# Altium project automatic bell.PrjPcb
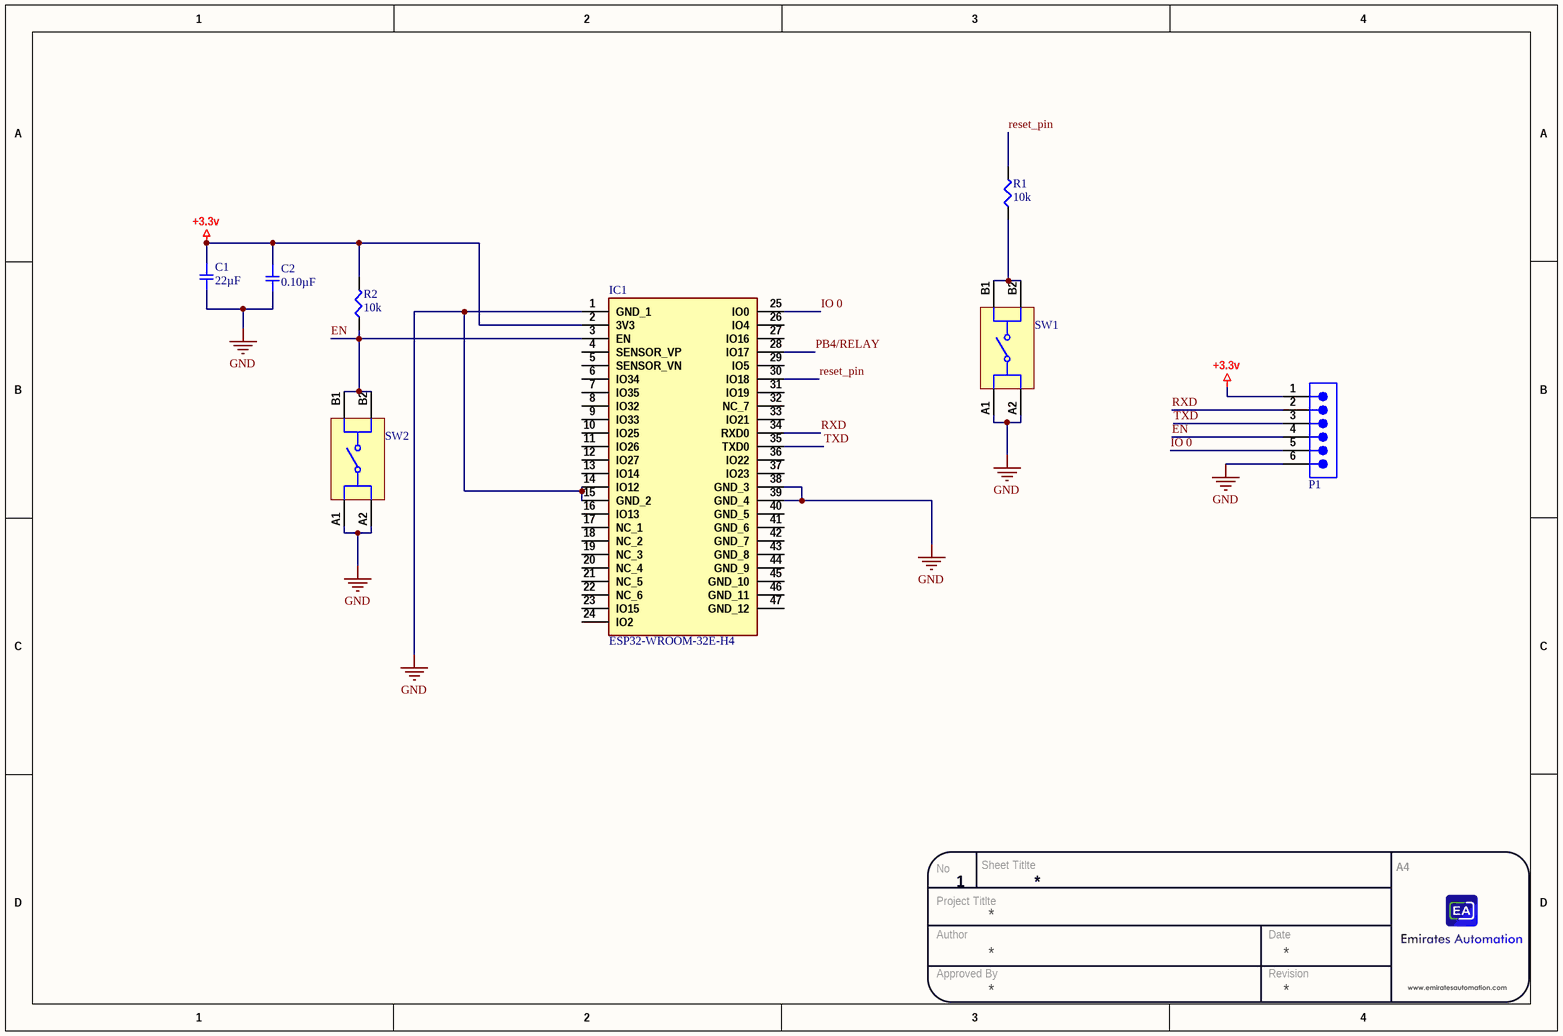
[diagram p0: main.SchDoc]
3 sheets, 36 parts. Net scope: global (net labels, ports and power ports of the same name join across sheets).
Board file: PCB.PcbDoc
Sheets:
  main.SchDoc
  relay and rtc.SchDoc
  power supply.SchDoc

## Sheet main.SchDoc
size A4; Organization: ORGANIZATION; Address1: ADDRESS 1; Address2: ADDRESS 2; Address3: ADDRESS 3; Address4: ADDRESS 4; Revision: -; SheetNumber: 1; SheetTotal: 3

### Parts
C1  22µF  [SMD-0603C]
C2  0.10µF  [SMD-0603C]
IC1  ESP32-WROOM-32E-H4  [ESP32WROOM32UEM113EH2800UH3Q0]
P1  61300611121  [61300611121]  (value not drawn)
R1  10k  [SMD-0603-RES]
R2  10k  [SMD-0603-RES]
SW1  430476085716  [430476085716]  (value not drawn)
SW2  430476085716  [430476085716]  (value not drawn)

### Nets
+3.3v: C1.1 C2.1 IC1.2(3V3) P1.1 R2.2
GND: C1.2 C2.2 IC1.1(GND_1) IC1.14(IO12) IC1.15(GND_2) IC1.38(GND_3) IC1.39(GND_4) P1.6 SW1.A1 SW1.A2 SW2.A1 SW2.A2
EN: IC1.3(EN) P1.4 R2.1 SW2.B1 SW2.B2
IO 0: IC1.25(IO0) P1.5
PB4/RELAY: IC1.28(IO17)
reset_pin: IC1.30(IO18) R1.2
RXD: IC1.34(RXD0) P1.2
TXD: IC1.35(TXD0) P1.3
NetR1_1: R1.1 SW1.B1 SW1.B2

Not connected (* = marked no-connect by the designer): IC1 4(SENSOR_VP) 5(SENSOR_VN) 6(IO34) 7(IO35) 8(IO32) 9(IO33) 10(IO25) 11(IO26) 12(IO27) 13(IO14) 16(IO13) 17(NC_1) 18(NC_2) 19(NC_3) 20(NC_4) 21(NC_5) 22(NC_6) 23(IO15) 24(IO2) 26(IO4) 27(IO16) 29(IO5) 31(IO19) 32(NC_7) 33(IO21) 36(IO22) 37(IO23) 40(GND_5) 41(GND_6) 42(GND_7) 43(GND_8) 44(GND_9) 45(GND_10) 46(GND_11) 47(GND_12)

### Notes on the sheet
- No
- Project Titlte
- Sheet Titlte
- A4
- Author
- Approved By
- Date
- Revision

### Library data of the parts
C1 = GRM188R61A226ME15D: CAP CER 22UF 10V X5R 0603; Manufacturer: Murata Electronics North America; Factory Stock: 0; Unit Price (USD): 0.24; Minimum Quantity: 1; Tolerance: ±20%; Datasheets: http://www.murata.com/~/media/webrenewal/support/library/catalog/products/capacitor/mlcc/c02e.pdf; Image: //media.digikey.com/Renders/Murata%20Renders/ZRB-SERIES-0402.jpg; Digi-Key Part Number: 490-10476-1-ND; Part Number: GRM188R61A226ME15D; Quantity Available: 179406; @ qty: 0; Packaging: Cut Tape (CT); Series: GRM; Part Status: Active; Value: 22µF; Voltage: 10V; Temperature Coefficient: X5R; Operating Temperature: -55°C ~ 85°C; Features: Derating Recommended; Ratings: -; Applications: General Purpose; Mounting Type: Surface Mount, MLCC; Package / Case: 0603 (1608 Metric); Size / Dimension: 0.063" L x 0.031" W (1.60mm x 0.80mm); Height - Seated (Max): -; Thickness (Max): 0.039" (1.00mm); Lead Spacing: -; Lead Style: -
C2 = GCJ188R71C104KA01D: CAP CER 0.1UF 16V X7R 0603; Manufacturer: Murata Electronics North America; Factory Stock: 0; Unit Price (USD): 0.21; Minimum Quantity: 1; Tolerance: ±10%; Datasheets: http://www.murata.com/~/media/webrenewal/support/library/catalog/products/capacitor/mlcc/c03e.ashx; Image: //media.digikey.com/Renders/Murata%20Renders/0603%28LQG18%29.jpg; Digi-Key Part Number: 490-5796-1-ND; Part Number: GCJ188R71C104KA01D; Quantity Available: 22473; @ qty: 0; Packaging: Cut Tape (CT); Series: GCJ; Part Status: Active; Value: 0.10µF; Voltage: 16V; Temperature Coefficient: X7R; Operating Temperature: -55°C ~ 125°C; Features: Soft Termination; Ratings: AEC-Q200; Applications: Automotive, Boardflex Sensitive; Mounting Type: Surface Mount, MLCC; Package / Case: 0603 (1608 Metric); Size / Dimension: 0.063" L x 0.031" W (1.60mm x 0.80mm); Height - Seated (Max): -; Thickness (Max): 0.035" (0.90mm); Lead Spacing: -; Lead Style: -
IC1 = ESP32-WROOM-32E-H4: Integrated Circuit; Manufacturer_Name: Espressif Systems; Datasheet Link: https://www.espressif.com/sites/default/files/documentation/esp32-wroom-32e_esp32-wroom-32ue_datasheet_en.pdf; Height: 3.25mm; Manufacturer_Part_Number: ESP32-WROOM-32E-H4; Mouser Part Number: 356-ESP32WRM320EH3PS; Mouser Price/Stock: https://www.mouser.co.uk/ProductDetail/Espressif-Systems/ESP32-WROOM-32E-H4?qs=Li%252BoUPsLEnuUxeqGSCz%252BcA%3D%3D
P1 = 61300611121: WR-PHD Pin Header, THT, Vertical, pitch 2.54mm, 1 Row, 6P; Manufacturer: Wurth Elektronik; Contact Resistance: 20mΩ; Rated Current: 3A; Working Voltage: 250V; Withstanding Voltage: 500V; ComponentLink1Description: Website Link; ComponentLink1URL: https://www.we-online.com/redexpert/article/61300611121?ad; ComponentLink2Description: Datasheet Link; ComponentLink2URL: https://www.we-online.com/redexpert/spec/61300611121?ad; Manufacturer Part Number: 61300611121; Category: Board-to-Board Connectors; Match Code: WR-PHD; Mount: Through Hole; Operating Temperature Max: 105°C; Operating Temperature Min: -40°C; Packaging: Bag; Gender: Pin Header; Number of Pins: 6; Number of Rows: 1; Orientation: Vertical; Pitch: 2.54mm
R1 R2 = ERJ-3EKF1002V: RES SMD 10K OHM 1% 1/10W 0603; Manufacturer: Panasonic Electronic Components; Factory Stock: 0; Unit Price (USD): 0.00379; @ qty: 1500; Minimum Quantity: 1; Power (Watts): 0.1W, 1/10W; Temperature Coefficient: ±100ppm/°C; Part Number: ERJ-3EKF1002V; Datasheets: http://industrial.panasonic.com/www-cgi/jvcr13pz.cgi?E+PZ+3+AOA0002+ERJ3EKF1002V+7+WW; Image: //media.digikey.com/Photos/Panasonic%20Photos/MFG_ERJ-P6W%20Series.jpg; Digi-Key Part Number: P10.0KHCT-ND; Quantity Available: 6703141; Packaging: Cut Tape (CT); Series: ERJ; Part Status: Active; Value: 10k; Tolerance: ±1%; Composition: Thick Film; Features: Automotive AEC-Q200; Operating Temperature: -55°C ~ 155°C; Package / Case: 0603 (1608 Metric); Supplier Device Package: 0603; Size / Dimension: 0.063" L x 0.031" W (1.60mm x 0.80mm); Height - Seated (Max): 0.022" (0.55mm); Number of Terminations: 2; Failure Rate: -
SW1 SW2 = 430476085716: WS-TATV THT Washable Tact Switch 12x12mm, 160g, SPST-NO, 12V, 50mA; Manufacturer: Wurth Elektronik; Washable: Yes; Manufacturer Part Number: 430476085716; Category: Tact Switches; Match Code: WS-TATV; ComponentLink1Description: Website Link; ComponentLink1URL: https://www.we-online.com/redexpert/article/430476085716?ad; ComponentLink2Description: Datasheet Link; ComponentLink2URL: https://www.we-online.com/redexpert/spec/430476085716?ad; Mount: Through Hole; Operating Temperature Max: 85°C; Operating Temperature Min: -40°C; Packaging: Bulk; Length: 12mm; Width: 12mm; Height: 8.5mm; Circuit: SPST-NO; Contact Material: Stainless Steel; Contact Plating: Silver; Operation Force: 160g; Rated Current: 50mA; Rated Voltage (DC): 12V; Terminal Material: Copper Alloy; Terminal Plating: Silver

## Sheet relay and rtc.SchDoc
size A4; Organization: ORGANIZATION; Address1: ADDRESS 1; Address2: ADDRESS 2; Address3: ADDRESS 3; Address4: ADDRESS 4; Revision: -; SheetNumber: 2; SheetTotal: 3
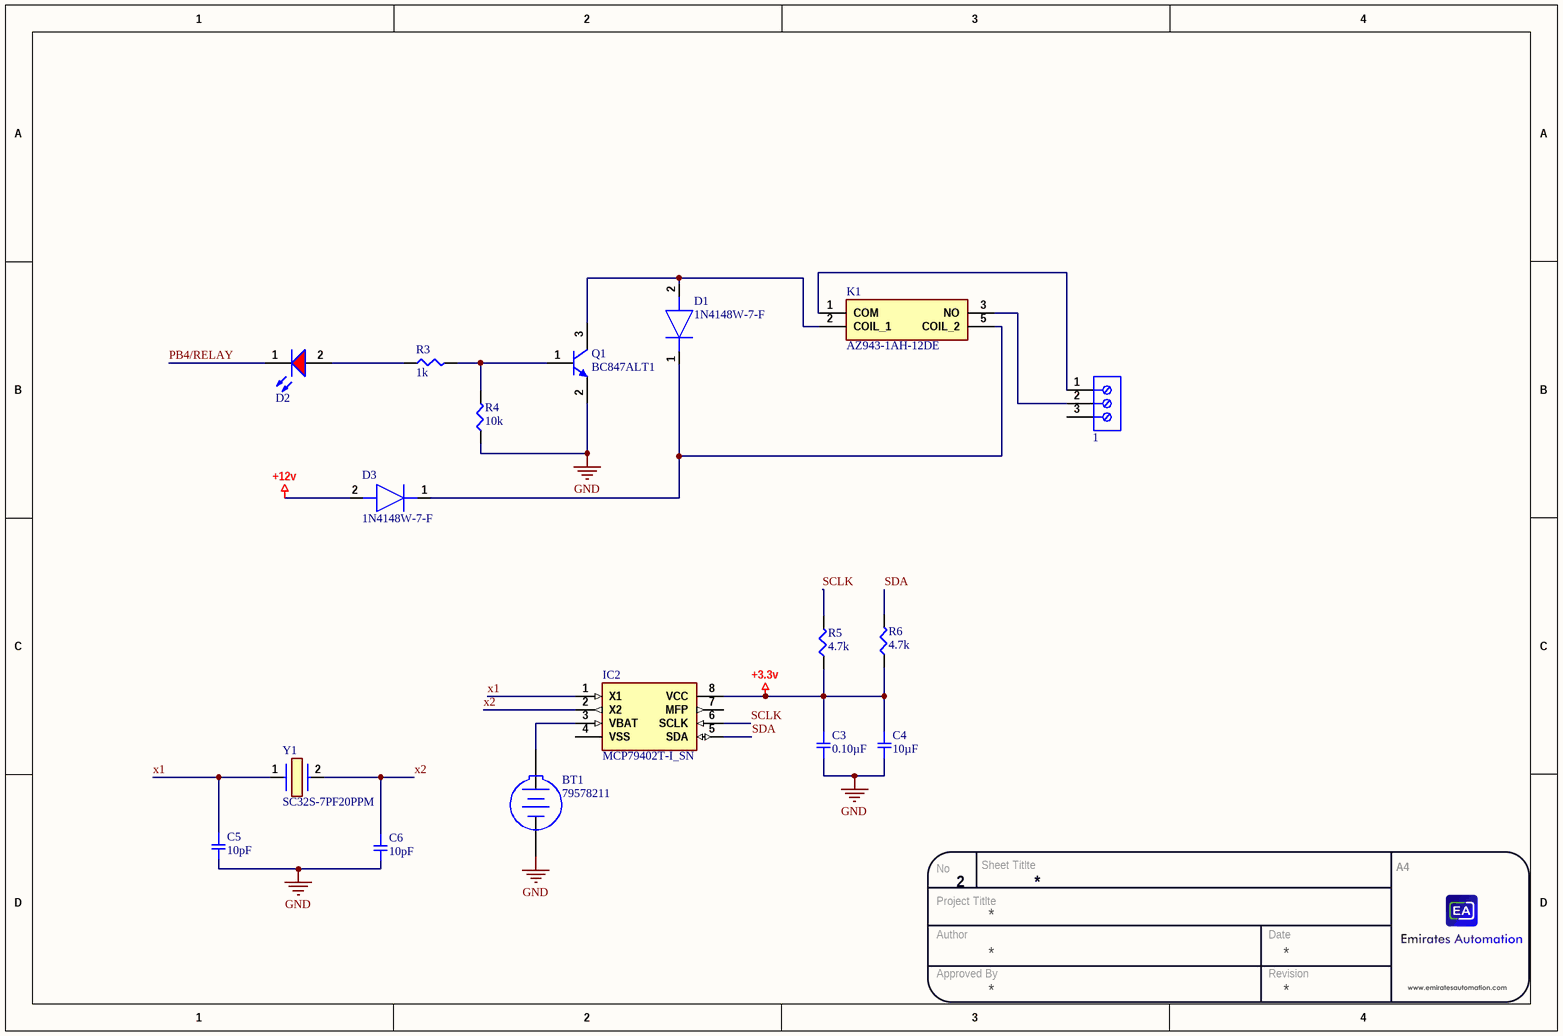
[diagram p1: relay and rtc.SchDoc]

### Parts
1  691101710003  [691101710003]  (value not drawn)
BT1  79578211  [79578211]
C3  0.10µF  [SMD-0603C]
C4  10µF  [SMD-0603C]
C5  10pF  [SMD-0603C]
C6  10pF  [SMD-0603C]
D1  1N4148W-7-F  [SOD3716X145N]
D2  Red, 2V, 140°  [WL-SMCD_0603]  (value not drawn)
D3  1N4148W-7-F  [SOD3716X145N]
IC2  MCP79402T-I_SN  [SOIC127P600X175-8N]
K1  AZ943-1AH-12DE  [AZ9431AH12DE]
Q1  BC847ALT1  [ONSC-SOT-23-3-318-08_V]
R3  1k  [SMD-0603-RES]
R4  10k  [SMD-0603-RES]
R5  4.7k  [SMD-0603-RES]
R6  4.7k  [SMD-0603-RES]
Y1  SC32S-7PF20PPM  [SC32S7PF20PPM]

### Nets
+3.3v: C3.1 C4.1 IC2.8(VCC) R5.1 R6.1
+12v: D3.2(A)
GND: BT1.2(-) C3.2 C4.2 C5.2 C6.2 Q1.2(E) R4.1
PB4/RELAY: D2.1(K)
SCLK: IC2.6(SCLK) R5.2
SDA: IC2.5(SDA) R6.2
x1: C5.1 IC2.1(X1) Y1.1
x2: C6.1 IC2.2(X2) Y1.2
Net1_1: 1.1 K1.1(COM)
Net1_2: 1.2 K1.3(NO)
NetBT1_1: BT1.1(+) IC2.3(VBAT)
NetD1_1: D1.1(K) D3.1(K) K1.5(COIL_2)
NetD1_2: D1.2(A) K1.2(COIL_1) Q1.3(C)
NetD2_2: D2.2(A) R3.1
NetQ1_1: Q1.1(B) R3.2 R4.2

Not connected (* = marked no-connect by the designer): 1 3; IC2 4(VSS) 7(MFP)

### Notes on the sheet
- No
- Project Titlte
- Sheet Titlte
- A4
- Author
- Approved By
- Date
- Revision

### Library data of the parts
1 = 691101710003: WR-TBL Series 101 Horizontal Entry Modular, THT, pitch 5mm, 3p; Manufacturer: Wurth Elektronik; Modularity: Yes; Rated Current: 16A; Working Voltage: 250V; ComponentLink1Description: Website Link; ComponentLink1URL: https://www.we-online.com/redexpert/article/691101710003?ad; ComponentLink2Description: Datasheet Link; ComponentLink2URL: https://www.we-online.com/redexpert/spec/691101710003?ad; Manufacturer Part Number: 691101710003; Category: Terminal Blocks; Match Code: WR-TBL; Mount: Through Hole; Operating Temperature Max: 105°C; Operating Temperature Min: -40°C; Packaging: Box; Application: Pressure Clamp; Number of Pins: 3; Number of Rows: 1; Orientation: Horizontal; Pitch: 5mm
BT1 = 79578211: WA-BCPH Battery Holder, THT, Battery Type 2450; Battery Type: 2450; ComponentLink1Description: Manufacturer; ComponentLink1URL: http://www.we-online.de; ComponentLink2Description: Datasheet; ComponentLink2URL: https://katalog.we-online.com/em/datasheet/79578211.pdf; Part Number: 79578211; Mounting Technology: THT; Operating Temperature: -40 to +105degC; Published Date: September 2019; Publisher: Wurth Elektronik; Packaging: Bag
C3 = GCJ188R71C104KA01D: as C2 on sheet main; Datasheets: http://www.murata.com/~/media/webrenewal/support/library/catalog/products/capacitor/mlcc/c03e.ashx; Image: //media.digikey.com/Renders/Murata%20Renders/0603%28LQG18%29.jpg; Digi-Key Part Number: 490-5796-1-ND; Part Number: GCJ188R71C104KA01D; Quantity Available: 22473; @ qty: 0; Packaging: Cut Tape (CT); Series: GCJ; Part Status: Active; Value: 0.10µF; Voltage: 16V; Temperature Coefficient: X7R; Operating Temperature: -55°C ~ 125°C; Features: Soft Termination; Ratings: AEC-Q200; Applications: Automotive, Boardflex Sensitive; Mounting Type: Surface Mount, MLCC; Package / Case: 0603 (1608 Metric); Size / Dimension: 0.063" L x 0.031" W (1.60mm x 0.80mm); Height - Seated (Max): -; Thickness (Max): 0.035" (0.90mm); Lead Spacing: -; Lead Style: -
C4 = GRM185R60J106ME15D: CAP CER 10UF 6.3V X5R 0603; Manufacturer: Murata Electronics North America; Factory Stock: 0; Unit Price (USD): 0.36; Minimum Quantity: 1; Tolerance: ±20%; Datasheets: http://www.murata.com/~/media/webrenewal/support/library/catalog/products/capacitor/mlcc/c02e.pdf; Image: //media.digikey.com/Renders/Murata%20Renders/ZRB-SERIES-0402.jpg; Digi-Key Part Number: 490-10467-1-ND; Part Number: GRM185R60J106ME15D; Quantity Available: 25068; @ qty: 0; Packaging: Cut Tape (CT); Series: GRM; Part Status: Active; Value: 10µF; Voltage: 6.3V; Temperature Coefficient: X5R; Operating Temperature: -55°C ~ 85°C; Features: Derating Recommended; Ratings: -; Applications: General Purpose; Mounting Type: Surface Mount, MLCC; Package / Case: 0603 (1608 Metric); Size / Dimension: 0.063" L x 0.031" W (1.60mm x 0.80mm); Height - Seated (Max): -; Thickness (Max): 0.022" (0.55mm); Lead Spacing: -; Lead Style: -
C5 C6 = GCM1885C1H100FA16D: CAP CER 10PF 50V NP0 0603; Manufacturer: Murata Electronics North America; Factory Stock: 0; Unit Price (USD): 0.11; Minimum Quantity: 1; Tolerance: ±1%; Temperature Coefficient: C0G, NP0; Datasheets: http://psearch.en.murata.com/capacitor/product/GCM1885C1H100FA16%23.pdf; Image: //media.digikey.com/Renders/Murata%20Renders/0603%28GCM188%29.jpg; Digi-Key Part Number: 490-12530-1-ND; Part Number: GCM1885C1H100FA16D; Quantity Available: 652; @ qty: 0; Packaging: Cut Tape (CT); Series: GCM; Part Status: Active; Value: 10pF; Voltage: 50V; Operating Temperature: -55°C ~ 125°C; Features: -; Ratings: AEC-Q200; Applications: Automotive; Mounting Type: Surface Mount, MLCC; Package / Case: 0603 (1608 Metric); Size / Dimension: 0.063" L x 0.031" W (1.60mm x 0.80mm); Height - Seated (Max): -; Thickness (Max): 0.035" (0.90mm); Lead Spacing: -; Lead Style: -
D1 D3 = 1N4148W-7-F: Diode; Manufacturer_Name: Diodes Incorporated; Datasheet Link: https://componentsearchengine.com/Datasheets/2/1N4148W-7-F.pdf; Height: 1.45mm; Manufacturer_Part_Number: 1N4148W-7-F; Mouser Part Number: 621-1N4148W-F; Mouser Price/Stock: https://www.mouser.co.uk/ProductDetail/Diodes-Incorporated/1N4148W-7-F?qs=LHX0FizJzg7Ae9ZM8LTAWw%3D%3D; Arrow Part Number: 1N4148W-7-F; Arrow Price/Stock: https://www.arrow.com/en/products/1n4148w-7-f/diodes-incorporated?region=nac
D2 = 150060RS55040: WL-SMCD Mono-color Chip LED Diffused, SMT, size 0603, Red, 2V, 140°; Manufacturer: Wurth Elektronik; Case/Size Code: 0603; Chip Technology: AlInGaP; Dominant Wavelength: 624nm; Luminous Intensity: 90mcd; Peak Wavelength: 632nm; Manufacturer Part Number: 150060RS55040; Category: Signal LEDs; Match Code: WL-SMCD; ComponentLink1Description: Website Link; ComponentLink1URL: https://www.we-online.com/redexpert/article/150060RS55040?ad; ComponentLink2Description: Datasheet Link; ComponentLink2URL: https://www.we-online.com/redexpert/spec/150060RS55040?ad; Mount: Surface Mount; Operating Temperature Max: 85°C; Operating Temperature Min: -40°C; Packaging: Tape and Reel; Length: 1.6mm; Width: 0.8mm; Height: 0.4mm; Emitting Color: Red; Forward Voltage: 2V; Viewing Angle: 140°
IC2 = MCP79402T-I_SN: Integrated Circuit; Manufacturer_Name: Microchip; Manufacturer_Part_Number: MCP79402T-I/SN; Datasheet Link: https://componentsearchengine.com/Datasheets/1/MCP79402T-I_SN.pdf; Height: 1.75mm; Mouser Part Number: 579-MCP79402TISN; Mouser Price/Stock: https://www.mouser.co.uk/ProductDetail/Microchip-Technology/MCP79402T-I-SN/?qs=ggQiQSXuoRU4tW%252BtaaWOXQ%3D%3D; Arrow Part Number: MCP79402T-I/SN; Arrow Price/Stock: https://www.arrow.com/en/products/mcp79402t-isn/microchip-technology?region=nac
K1 = AZ943-1AH-12DE: Relay or Contactor; Manufacturer_Name: Zettler Group; Datasheet Link: https://www.azettler.com/pdfs/az943.pdf; Height: 15.95mm; Manufacturer_Part_Number: AZ943-1AH-12DE
Q1 = BC847ALT1: General Purpose Transistor, NPN Silicon, 3-Pin SOT-23, Tape and Reel; Manufacturer: On Semiconductor; fT Min (MHz): 100; IC Continuous (A): 0.1; DatasheetVersion: Rev. 11; PackageVersion: Rev. AP, 11/2009; PackageReference: SOT-23-3-318-08; PackageDescription: 3-Pin Small Outline Transistor, Body 2.92 x 1.3 mm, Pitch 0.95 mm; Supplier 1: Digi-Key; Supplier Part Number 1: BC847ALT1OSCT-ND; Packing: Tape and Reel; Polarity: NPN; RoHS: FALSE; Mounting Technology: Surface Mount; PartNumber: BC847ALT1; ComponentLink1Description: Manufacturer URL; ComponentLink1URL: http://www.onsemi.com/; ComponentLink2Description: Datasheet; ComponentLink2URL: http://www.onsemi.cn/pub_link/Collateral/BC846ALT1-D.PDF; ComponentLink3Description: Package Specification; ComponentLink3URL: http://www.onsemi.cn/pub_link/Collateral/318-08.PDF
R3 = ERJ-3EKF1001V: RES SMD 1K OHM 1% 1/10W 0603; Manufacturer: Panasonic Electronic Components; Factory Stock: 0; Unit Price (USD): 0.00379; @ qty: 1500; Minimum Quantity: 1; Power (Watts): 0.1W, 1/10W; Temperature Coefficient: ±100ppm/°C; Part Number: ERJ-3EKF1001V; Datasheets: http://industrial.panasonic.com/www-cgi/jvcr13pz.cgi?E+PZ+3+AOA0002+ERJ3EKF1001V+7+WW; Image: //media.digikey.com/Photos/Panasonic%20Photos/MFG_ERJ-P6W%20Series.jpg; Digi-Key Part Number: P1.00KHCT-ND; Quantity Available: 5218845; Packaging: Cut Tape (CT); Series: ERJ; Part Status: Active; Value: 1k; Tolerance: ±1%; Composition: Thick Film; Features: Automotive AEC-Q200; Operating Temperature: -55°C ~ 155°C; Package / Case: 0603 (1608 Metric); Supplier Device Package: 0603; Size / Dimension: 0.063" L x 0.031" W (1.60mm x 0.80mm); Height - Seated (Max): 0.022" (0.55mm); Number of Terminations: 2; Failure Rate: -
R4 = ERJ-3EKF1002V: as R1 on sheet main; Part Number: ERJ-3EKF1002V; Datasheets: http://industrial.panasonic.com/www-cgi/jvcr13pz.cgi?E+PZ+3+AOA0002+ERJ3EKF1002V+7+WW; Image: //media.digikey.com/Photos/Panasonic%20Photos/MFG_ERJ-P6W%20Series.jpg; Digi-Key Part Number: P10.0KHCT-ND; Quantity Available: 6703141; Packaging: Cut Tape (CT); Series: ERJ; Part Status: Active; Value: 10k; Tolerance: ±1%; Composition: Thick Film; Features: Automotive AEC-Q200; Operating Temperature: -55°C ~ 155°C; Package / Case: 0603 (1608 Metric); Supplier Device Package: 0603; Size / Dimension: 0.063" L x 0.031" W (1.60mm x 0.80mm); Height - Seated (Max): 0.022" (0.55mm); Number of Terminations: 2; Failure Rate: -
R5 = ERJ-3EKF4701V: RES SMD 4.7K OHM 1% 1/10W 0603; Manufacturer: Panasonic Electronic Components; Factory Stock: 0; Unit Price (USD): 0.00379; @ qty: 1500; Minimum Quantity: 1; Power (Watts): 0.1W, 1/10W; Temperature Coefficient: ±100ppm/°C; Part Number: ERJ-3EKF4701V; Datasheets: http://industrial.panasonic.com/www-cgi/jvcr13pz.cgi?E+PZ+3+AOA0002+ERJ3EKF4701V+7+WW; Image: //media.digikey.com/Photos/Panasonic%20Photos/MFG_ERJ-P6W%20Series.jpg; Digi-Key Part Number: P4.70KHCT-ND; Quantity Available: 999380; Packaging: Cut Tape (CT); Series: ERJ; Part Status: Active; Value: 4.7k; Tolerance: ±1%; Composition: Thick Film; Features: Automotive AEC-Q200; Operating Temperature: -55°C ~ 155°C; Package / Case: 0603 (1608 Metric); Supplier Device Package: 0603; Size / Dimension: 0.063" L x 0.031" W (1.60mm x 0.80mm); Height - Seated (Max): 0.022" (0.55mm); Number of Terminations: 2; Failure Rate: -
R6 = ERJ-3GEYJ472V: RES SMD 4.7K OHM 5% 1/10W 0603; Manufacturer: Panasonic Electronic Components; Factory Stock: 0; Unit Price (USD): 0.00321; @ qty: 1500; Minimum Quantity: 1; Power (Watts): 0.1W, 1/10W; Temperature Coefficient: ±200ppm/°C; Part Number: ERJ-3GEYJ472V; Datasheets: http://industrial.panasonic.com/www-cgi/jvcr13pz.cgi?E+PZ+3+AOA0001+ERJ3GEYJ472V+7+WW; Image: //media.digikey.com/Photos/Panasonic%20Photos/MFG_ERJ-P6W%20Series.jpg; Digi-Key Part Number: P4.7KGCT-ND; Quantity Available: 683531; Packaging: Cut Tape (CT); Series: ERJ; Part Status: Active; Value: 4.7k; Tolerance: ±5%; Composition: Thick Film; Features: Automotive AEC-Q200; Operating Temperature: -55°C ~ 155°C; Package / Case: 0603 (1608 Metric); Supplier Device Package: 0603; Size / Dimension: 0.063" L x 0.031" W (1.60mm x 0.80mm); Height - Seated (Max): 0.022" (0.55mm); Number of Terminations: 2; Failure Rate: -
Y1 = SC32S-7PF20PPM: Crystal or Oscillator; Manufacturer_Name: Seiko Semiconductors; Datasheet Link: https://www.mouser.com/datasheet/2/360/file_PRODUCT_MASTER_50812_GRAPHIC03-542305.pdf; Manufacturer_Part_Number: SC32S-7PF20PPM; Mouser Part Number: 628-SC32S-7PF20PPM; Mouser Price/Stock: https://www.mouser.co.uk/ProductDetail/Seiko-Semiconductors/SC32S-7PF20PPM?qs=3CPZD7qAgigZSR1ASVAS6w%3D%3D

## Sheet power supply.SchDoc
size A4; Organization: ORGANIZATION; Address1: ADDRESS 1; Address2: ADDRESS 2; Address3: ADDRESS 3; Address4: ADDRESS 4; Revision: -; SheetNumber: 3; SheetTotal: 3
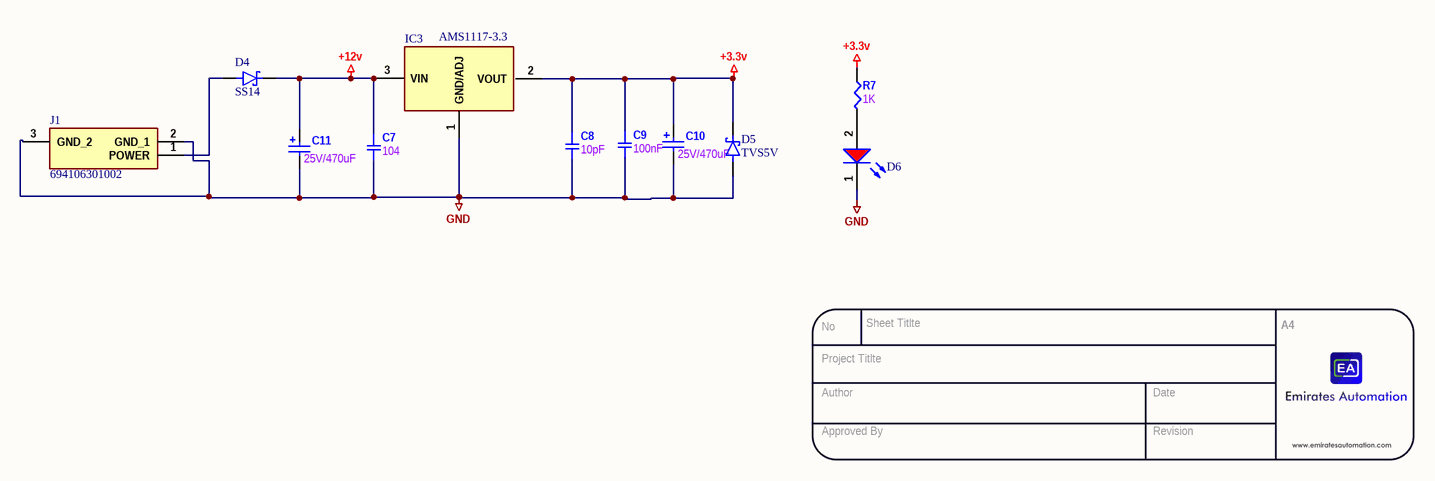
[diagram p2: power supply.SchDoc]

### Parts
C7  104  [SMD-1206C]
C8  10pF  [SMD-1206C]
C9  100nF  [SMD-1206C]
C10  25V/470uF  [WCAP-ATUL_8x11.5x3.5]
C11  25V/470uF  [WCAP-ATUL_8x11.5x3.5]
D4  SS14  [DIOM4325X250N]
D5  TVS5V  [DIOM4325X250N]
D6  Red, 2V, 140°  [WL-SMCD_0603]  (value not drawn)
IC3  AMS1117-3.3  [SOT229P700X180-4N]
J1  694106301002  [694106301002_1]
R7  1K  [SMD-0805-RES]

### Nets
+3.3v: C8.1 C9.1 C10.1(P) D5.C(K) IC3.2(VOUT) R7.1
+12v: C7.1 C11.1(P) D4.C(K) IC3.3(VIN)
GND: C7.2 C8.2 C9.2 C10.2(N) C11.2(N) D5.A D6.1(K) IC3.1(GND/ADJ) J1.2(GND_1) J1.3(GND_2)
NetD4_A: D4.A J1.1(POWER)
NetD6_2: D6.2(A) R7.2

### Notes on the sheet
- No
- Project Titlte
- Sheet Titlte
- A4
- Author
- Approved By
- Date
- Revision

### Library data of the parts
C7 = GC331AD72E333KX01D: CAP CER 0.033UF 250V X7T 1206; Manufacturer: Murata Electronics North America; Factory Stock: 0; Unit Price (USD): 0.33; Minimum Quantity: 1; Value: 0.033µF; Tolerance: ±10%; Datasheets: http://search.murata.co.jp/Ceramy/image/img/A01X/G101/ENG/GC331AD72E333KX01-01.pdf; Image: //media.digikey.com/Renders/Murata%20Renders/1206(GC3)320x160.jpg; Digi-Key Part Number: 490-13989-1-ND; Part Number: GC331AD72E333KX01D; Quantity Available: 3999; @ qty: 0; Packaging: Cut Tape (CT); Series: GC3; Part Status: Active; Voltage: 250V; Temperature Coefficient: X7T; Operating Temperature: -55°C ~ 125°C; Features: -; Ratings: AEC-Q200; Applications: Automotive; Mounting Type: Surface Mount, MLCC; Package / Case: 1206 (3216 Metric); Size / Dimension: 0.126" L x 0.063" W (3.20mm x 1.60mm); Height - Seated (Max): -; Thickness (Max): 0.039" (1.00mm); Lead Spacing: -; Lead Style: -
C8 = GC331AD72E333KX01D: CAP CER 10PF 50V NP0 1206; Manufacturer: Murata Electronics North America; Factory Stock: 0; Unit Price (USD): 0.33; Minimum Quantity: 1; Value: 0.033µF; Tolerance: ±10%; Voltage: 250V; Temperature Coefficient: X7T; Datasheets: http://search.murata.co.jp/Ceramy/image/img/A01X/G101/ENG/GC331AD72E333KX01-01.pdf; Image: //media.digikey.com/Renders/Murata%20Renders/1206(GC3)320x160.jpg; Digi-Key Part Number: 490-13989-1-ND; Part Number: GC331AD72E333KX01D; Quantity Available: 3999; @ qty: 0; Packaging: Cut Tape (CT); Series: GC3; Part Status: Active; Operating Temperature: -55°C ~ 125°C; Features: -; Ratings: AEC-Q200; Applications: Automotive; Mounting Type: Surface Mount, MLCC; Package / Case: 1206 (3216 Metric); Size / Dimension: 0.126" L x 0.063" W (3.20mm x 1.60mm); Height - Seated (Max): -; Thickness (Max): 0.039" (1.00mm); Lead Spacing: -; Lead Style: -
C9 = GC331AD72E333KX01D: CAP CER 0.1UF 50V X7R 1206; Manufacturer: Murata Electronics North America; Factory Stock: 0; Unit Price (USD): 0.33; Minimum Quantity: 1; Value: 0.033µF; Tolerance: ±10%; Voltage: 250V; Temperature Coefficient: X7T; Datasheets: http://search.murata.co.jp/Ceramy/image/img/A01X/G101/ENG/GC331AD72E333KX01-01.pdf; Image: //media.digikey.com/Renders/Murata%20Renders/1206(GC3)320x160.jpg; Digi-Key Part Number: 490-13989-1-ND; Part Number: GC331AD72E333KX01D; Quantity Available: 3999; @ qty: 0; Packaging: Cut Tape (CT); Series: GC3; Part Status: Active; Operating Temperature: -55°C ~ 125°C; Features: -; Ratings: AEC-Q200; Applications: Automotive; Mounting Type: Surface Mount, MLCC; Package / Case: 1206 (3216 Metric); Size / Dimension: 0.126" L x 0.063" W (3.20mm x 1.60mm); Height - Seated (Max): -; Thickness (Max): 0.039" (1.00mm); Lead Spacing: -; Lead Style: -
C10 C11 = 860040474004: WCAP-ATUL Aluminum Electrolytic Capacitors, 8x11.5mm, 25 Vdc, 220 uF; Rated Voltage: 25 Vdc; Value: 220 uF; ComponentLink1Description: Manufacturer; ComponentLink1URL: http://www.we-online.de; ComponentLink2Description: Datasheet; ComponentLink2URL: http://katalog.we-online.com/pbs/datasheet/860040474004.pdf; Part Number: 860040474004; Published Date: Sep. 2017; Publisher: Wurth Elektronik; Size: 8x11.5mm; Life Cycle: 7000h; Operating Temperature: -40 °C up to +105 °C
D5 = SS14: Value: *; Availability: Unavailable; Price: None; Package: None; MP: SS14
D6 = 150060RS55040: as D2 on sheet relay and rtc; Manufacturer Part Number: 150060RS55040; Category: Signal LEDs; Match Code: WL-SMCD; ComponentLink1Description: Website Link; ComponentLink1URL: https://www.we-online.com/redexpert/article/150060RS55040?ad; ComponentLink2Description: Datasheet Link; ComponentLink2URL: https://www.we-online.com/redexpert/spec/150060RS55040?ad; Mount: Surface Mount; Operating Temperature Max: 85°C; Operating Temperature Min: -40°C; Packaging: Tape and Reel; Length: 1.6mm; Width: 0.8mm; Height: 0.4mm; Emitting Color: Red; Forward Voltage: 2V; Viewing Angle: 140°
IC3 = AMS1117-3.3: Integrated Circuit; Manufacturer_Name: Advanced; Datasheet Link: https://datasheet.datasheetarchive.com/originals/distributors/Datasheets-28/DSA-550594.pdf; Height: 1.8mm; Manufacturer_Part_Number: AMS1117-3.3
J1 = 694106301002: Connector; Manufacturer_Name: Wurth Elektronik; Datasheet Link: https://datasheet.datasheetarchive.com/originals/distributors/Datasheets_SAMA/1c153bd2ba42bb51bda59ee4cd9765cd.pdf; Manufacturer_Part_Number: 694106301002; Mouser Part Number: 710-694106301002; Mouser Price/Stock: https://www.mouser.co.uk/ProductDetail/Wurth-Elektronik/694106301002?qs=a9WhcLg8qCwOEkcI62k5mA%3D%3D
R7 = ERJ-6BQF1R0V: RES SMD 1 OHM 1% 1/3W 0805; Manufacturer: Panasonic Electronic Components; Factory Stock: 0; Unit Price (USD): 0.05834; @ qty: 1500; Minimum Quantity: 1; Value: 1; Power (Watts): 0.333W, 1/3W; Temperature Coefficient: ±200ppm/°C; Part Number: ERJ-6BQF1R0V; Datasheets: https://industrial.panasonic.com/cdbs/www-data/pdf/RDA0000/AOA0000C239.pdf; Image: //media.digikey.com/Renders/Panasonic%20Renders/ERJ-0805%20Pkg.jpg; Digi-Key Part Number: P17499CT-ND; Quantity Available: 808; Packaging: Cut Tape (CT); Series: ERJ; Part Status: Active; Tolerance: ±1%; Composition: Thick Film; Features: Automotive AEC-Q200, Current Sense; Operating Temperature: -55°C ~ 125°C; Package / Case: 0805 (2012 Metric); Supplier Device Package: 0805; Size / Dimension: 0.079" L x 0.049" W (2.00mm x 1.25mm); Height - Seated (Max): 0.028" (0.70mm); Number of Terminations: 2; Failure Rate: -
D4 = SS14: Value: *; Availability: Unavailable; Price: None; Package: None; MP: SS14

## Nets that join several sheets
+3.3v: main (5 pins), relay and rtc (5 pins), power supply (6 pins)
+12v: relay and rtc (D3.2), power supply (C7.1 C11.1 D4.C IC3.3)
GND: main (12 pins), relay and rtc (7 pins), power supply (10 pins)
PB4/RELAY: main (IC1.28), relay and rtc (D2.1)